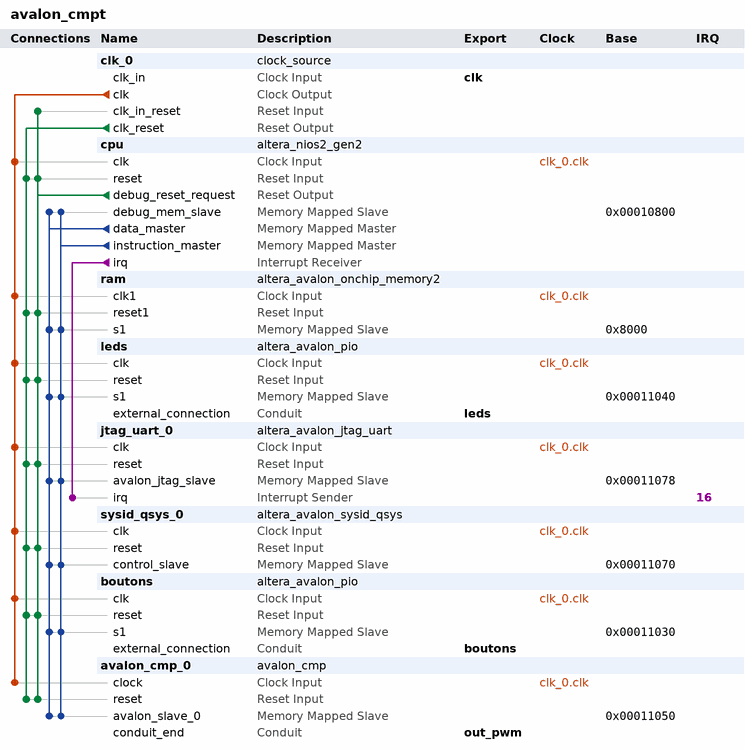
[diagram p0: system contents]
# Platform Designer (Qsys) system avalon_cmpt, Cyclone IV E EP4CE22F17C6
# Parameters at their usual value, and those the tool derives, are not listed.
package require -exact qsys 18.1
create_system avalon_cmpt
set_project_property DEVICE_FAMILY {Cyclone IV E}
set_project_property DEVICE EP4CE22F17C6

add_instance clk_0 clock_source 18.1
set_instance_parameter_value clk_0 clockFrequency 50000000

add_instance cpu altera_nios2_gen2 18.1
set_instance_parameter_value cpu dcache_size 2048
set_instance_parameter_value cpu exceptionSlave ram.s1
set_instance_parameter_value cpu icache_size 4096
set_instance_parameter_value cpu impl Tiny
set_instance_parameter_value cpu resetSlave ram.s1

add_instance ram altera_avalon_onchip_memory2 18.1
set_instance_parameter_value ram dataWidth 32
set_instance_parameter_value ram dualPort false
set_instance_parameter_value ram initMemContent true
set_instance_parameter_value ram initializationFileName onchip_mem.hex
set_instance_parameter_value ram memorySize 20480

add_instance leds altera_avalon_pio 18.1
set_instance_parameter_value leds direction Output
set_instance_parameter_value leds width 8

add_instance jtag_uart_0 altera_avalon_jtag_uart 18.1
set_instance_parameter_value jtag_uart_0 simInteractiveOptions NO_INTERACTIVE_WINDOWS

add_instance sysid_qsys_0 altera_avalon_sysid_qsys 18.1
set_instance_parameter_value sysid_qsys_0 id 0

add_instance boutons altera_avalon_pio 18.1
set_instance_parameter_value boutons direction Input
set_instance_parameter_value boutons width 2

add_instance avalon_cmp_0 avalon_cmp 1.0

# connections
add_connection clk_0.clk avalon_cmp_0.clock clock
add_connection clk_0.clk boutons.clk clock
add_connection clk_0.clk cpu.clk clock
add_connection clk_0.clk jtag_uart_0.clk clock
add_connection clk_0.clk leds.clk clock
add_connection clk_0.clk ram.clk1 clock
add_connection clk_0.clk sysid_qsys_0.clk clock
add_connection clk_0.clk_reset avalon_cmp_0.reset reset
add_connection clk_0.clk_reset boutons.reset reset
add_connection clk_0.clk_reset cpu.reset reset
add_connection clk_0.clk_reset jtag_uart_0.reset reset
add_connection clk_0.clk_reset leds.reset reset
add_connection clk_0.clk_reset ram.reset1 reset
add_connection clk_0.clk_reset sysid_qsys_0.reset reset
add_connection cpu.debug_reset_request avalon_cmp_0.reset reset
add_connection cpu.debug_reset_request boutons.reset reset
add_connection cpu.debug_reset_request clk_0.clk_in_reset reset
add_connection cpu.debug_reset_request cpu.reset reset
add_connection cpu.debug_reset_request jtag_uart_0.reset reset
add_connection cpu.debug_reset_request leds.reset reset
add_connection cpu.debug_reset_request ram.reset1 reset
add_connection cpu.debug_reset_request sysid_qsys_0.reset reset
add_connection cpu.data_master avalon_cmp_0.avalon_slave_0 avalon
set_connection_parameter_value cpu.data_master/avalon_cmp_0.avalon_slave_0 baseAddress 0x00011050
add_connection cpu.data_master boutons.s1 avalon
set_connection_parameter_value cpu.data_master/boutons.s1 baseAddress 0x00011030
add_connection cpu.data_master cpu.debug_mem_slave avalon
set_connection_parameter_value cpu.data_master/cpu.debug_mem_slave baseAddress 0x00010800
add_connection cpu.data_master jtag_uart_0.avalon_jtag_slave avalon
set_connection_parameter_value cpu.data_master/jtag_uart_0.avalon_jtag_slave baseAddress 0x00011078
add_connection cpu.data_master leds.s1 avalon
set_connection_parameter_value cpu.data_master/leds.s1 baseAddress 0x00011040
add_connection cpu.data_master ram.s1 avalon
set_connection_parameter_value cpu.data_master/ram.s1 baseAddress 0x8000
add_connection cpu.data_master sysid_qsys_0.control_slave avalon
set_connection_parameter_value cpu.data_master/sysid_qsys_0.control_slave baseAddress 0x00011070
add_connection cpu.instruction_master avalon_cmp_0.avalon_slave_0 avalon
set_connection_parameter_value cpu.instruction_master/avalon_cmp_0.avalon_slave_0 baseAddress 0x00011050
add_connection cpu.instruction_master boutons.s1 avalon
set_connection_parameter_value cpu.instruction_master/boutons.s1 baseAddress 0x00011030
add_connection cpu.instruction_master cpu.debug_mem_slave avalon
set_connection_parameter_value cpu.instruction_master/cpu.debug_mem_slave baseAddress 0x00010800
add_connection cpu.instruction_master jtag_uart_0.avalon_jtag_slave avalon
set_connection_parameter_value cpu.instruction_master/jtag_uart_0.avalon_jtag_slave baseAddress 0x00011078
add_connection cpu.instruction_master leds.s1 avalon
set_connection_parameter_value cpu.instruction_master/leds.s1 baseAddress 0x00011040
add_connection cpu.instruction_master ram.s1 avalon
set_connection_parameter_value cpu.instruction_master/ram.s1 baseAddress 0x8000
add_connection cpu.instruction_master sysid_qsys_0.control_slave avalon
set_connection_parameter_value cpu.instruction_master/sysid_qsys_0.control_slave baseAddress 0x00011070
add_connection cpu.irq jtag_uart_0.irq interrupt
set_connection_parameter_value cpu.irq/jtag_uart_0.irq irqNumber 16

# exported interfaces
add_interface boutons conduit end
set_interface_property boutons EXPORT_OF boutons.external_connection
add_interface clk clock sink
set_interface_property clk EXPORT_OF clk_0.clk_in
add_interface leds conduit end
set_interface_property leds EXPORT_OF leds.external_connection
add_interface out_pwm conduit end
set_interface_property out_pwm EXPORT_OF avalon_cmp_0.conduit_end

set_interconnect_requirement {$system} qsys_mm.clockCrossingAdapter HANDSHAKE
set_interconnect_requirement {$system} qsys_mm.enableEccProtection FALSE
set_interconnect_requirement {$system} qsys_mm.insertDefaultSlave FALSE
set_interconnect_requirement {$system} qsys_mm.maxAdditionalLatency 1

save_system avalon_cmpt.qsys
